# Altium project STM32_W5500_Baseboard.PrjPcb
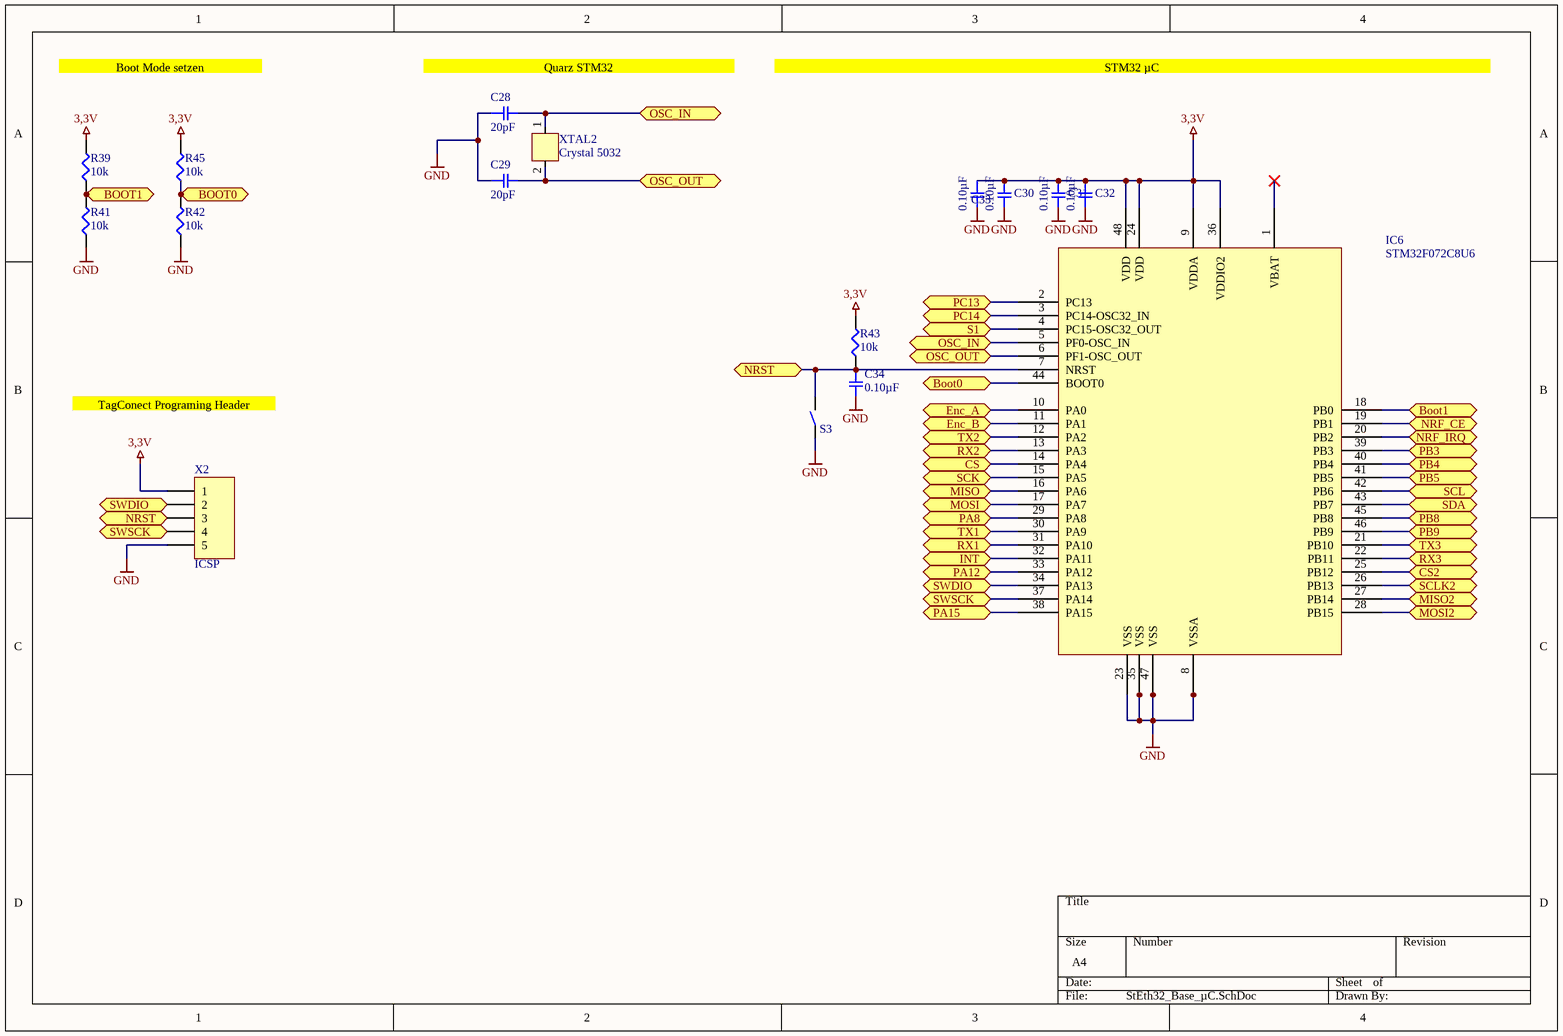
[diagram p0: StEth32_Base_µC.SchDoc]
4 sheets, 110 parts. Net scope: flat (ports and power ports of the same name join across sheets).
Board file: StEth32_Base.PcbDoc
Sheets:
  StEth32_Base_µC.SchDoc
  StEth32_Base_OLED_UserIO.SchDoc
  StEth32_Base_Power_Output.SchDoc
  StEth32_Base_W5500.SchDoc

## Sheet StEth32_Base_µC.SchDoc
size A4

### Parts
C28  20pF  [SMD-0603C]
C29  20pF  [SMD-0603C]
C30  0.10µF  [SMD-0603C]
C31  0.10µF  [SMD-0603C]
C32  0.10µF  [SMD-0603C]
C33  0.10µF  [SMD-0603C]
C34  0.10µF  [SMD-0603C]
IC6  STM32F072C8U6  [LQFP-48]
R39  10k  [SMD-0603-RES]
R41  10k  [SMD-0603-RES]
R42  10k  [SMD-0603-RES]
R43  10k  [SMD-0603-RES]
R45  10k  [SMD-0603-RES]
S3  Button  [Button5050]  (value not drawn)
X2  ICSP  [TC2030-MCP-NL]
XTAL2  Crystal 5032  [5032]

### Ports
Boot0 (bidir), BOOT0 (bidir), BOOT1 (bidir), Boot1 (bidir), CS2 (bidir), CS (bidir), Enc_A (bidir), Enc_B (bidir), INT (bidir), MISO2 (bidir), MISO (bidir), MOSI2 (bidir), MOSI (bidir), NRF_CE (bidir), NRF_IRQ (bidir), NRST (bidir), OSC_IN (bidir), OSC_OUT (bidir), PA8 (bidir), PA12 (bidir), PA15 (bidir), PB3 (bidir), PB4 (bidir), PB5 (bidir), PB8 (bidir), PB9 (bidir), PC13 (bidir), PC14 (bidir), RX1 (bidir), RX2 (bidir), RX3 (bidir), S1 (bidir), SCK (bidir), SCL (bidir), SCLK2 (bidir), SDA (bidir), SWDIO (bidir), SWSCK (bidir), TX1 (bidir), TX2 (bidir), TX3 (bidir)

### Nets
3,3V: C30.1 C31.1 C32.1 C33.1 IC6.9(VDDA) IC6.24(VDD) IC6.36(VDDIO2) IC6.48(VDD) R39.2 R43.2 R45.2 X2.1
GND: C28.1 C29.1 C30.2 C31.2 C32.2 C33.2 C34.2 IC6.8(VSSA) IC6.23(VSS) IC6.35(VSS) IC6.47(VSS) R41.1 R42.1 S3.1 X2.5
NetC28_2: C28.2 IC6.5(PF0-OSC_IN) XTAL2.1 ; port OSC_IN
NetC29_2: C29.2 IC6.6(PF1-OSC_OUT) XTAL2.2 ; port OSC_OUT
NetC34_1: C34.1 IC6.7(NRST) R43.1 S3.2 X2.3 ; port NRST
NetIC1_18: IC6.42(PB6) ; port SCL
NetIC1_19: IC6.43(PB7) ; port SDA
NetIC2_CE: IC6.19(PB1) ; port NRF_CE
NetIC2_CSN: IC6.14(PA4) ; port CS
NetIC2_IRQ: IC6.20(PB2) ; port NRF_IRQ
NetIC2_MISO: IC6.16(PA6) ; port MISO
NetIC2_MOSI: IC6.17(PA7) ; port MOSI
NetIC2_SCK: IC6.15(PA5) ; port SCK
NetIC5_32: IC6.25(PB12) ; port CS2
NetIC5_33: IC6.26(PB13) ; port SCLK2
NetIC5_34: IC6.27(PB14) ; port MISO2
NetIC5_35: IC6.28(PB15) ; port MOSI2
NetIC5_36: IC6.32(PA11) ; port INT
NetIC6_2: IC6.2(PC13) ; port PC13
NetIC6_3: IC6.3(PC14-OSC32_IN) ; port PC14
NetIC6_4: IC6.4(PC15-OSC32_OUT) ; port S1
NetIC6_10: IC6.10(PA0) ; port Enc_A
NetIC6_11: IC6.11(PA1) ; port Enc_B
NetIC6_12: IC6.12(PA2) ; port TX2
NetIC6_13: IC6.13(PA3) ; port RX2
NetIC6_18: IC6.18(PB0) R39.1 R41.2 ; port BOOT1, port Boot1
NetIC6_21: IC6.21(PB10) ; port TX3
NetIC6_22: IC6.22(PB11) ; port RX3
NetIC6_29: IC6.29(PA8) ; port PA8
NetIC6_30: IC6.30(PA9) ; port TX1
NetIC6_31: IC6.31(PA10) ; port RX1
NetIC6_33: IC6.33(PA12) ; port PA12
NetIC6_34: IC6.34(PA13) X2.2 ; port SWDIO
NetIC6_37: IC6.37(PA14) X2.4 ; port SWSCK
NetIC6_38: IC6.38(PA15) ; port PA15
NetIC6_39: IC6.39(PB3) ; port PB3
NetIC6_40: IC6.40(PB4) ; port PB4
NetIC6_41: IC6.41(PB5) ; port PB5
NetIC6_44: IC6.44(BOOT0) R42.2 R45.1 ; port Boot0, port BOOT0
NetIC6_45: IC6.45(PB8) ; port PB8
NetIC6_46: IC6.46(PB9) ; port PB9

Not connected (* = marked no-connect by the designer): IC6 1(VBAT)*

### Notes on the sheet
- Boot Mode setzen
- Quarz STM32
- STM32 µC
  STM32 µC
- TagConect Programing Header

### Library data of the parts
C28-C34 = GCM188R71C104KA37J: CAP CER 0.1UF 16V X7R 0603; Manufacturer: Murata Electronics North America; Factory Stock: 0; Unit Price (USD): 0.18; Minimum Quantity: 1; Tolerance: ±10%; Datasheets: http://www.murata.com/~/media/webrenewal/support/library/catalog/products/capacitor/mlcc/c03e.ashx; Image: //media.digikey.com/Renders/Murata%20Renders/0603%28GCM188%29.jpg; Digi-Key Part Number: 490-8015-1-ND; Part Number: GCM188R71C104KA37J; Quantity Available: 17844; @ qty: 0; Packaging: Cut Tape (CT); Series: GCM; Part Status: Active; Voltage: 16V; Temperature Coefficient: X7R; Operating Temperature: -55°C ~ 125°C; Features: -; Ratings: AEC-Q200; Applications: Automotive; Mounting Type: Surface Mount, MLCC; Package / Case: 0603 (1608 Metric); Size / Dimension: 0.063" L x 0.031" W (1.60mm x 0.80mm); Height - Seated (Max): -; Thickness (Max): 0.035" (0.90mm); Lead Spacing: -; Lead Style: -
  C28 C29: Value: 20pF
  C30-C34: Value: 0.10µF
R39 R41-R43 R45 = ERJ-3EKF1002V: RES SMD 10K OHM 1% 1/10W 0603; Manufacturer: Panasonic Electronic Components; Factory Stock: 0; Unit Price (USD): 0.00379; @ qty: 1500; Minimum Quantity: 1; Power (Watts): 0.1W, 1/10W; Temperature Coefficient: ±100ppm/°C; Part Number: ERJ-3EKF1002V; Datasheets: http://industrial.panasonic.com/www-cgi/jvcr13pz.cgi?E+PZ+3+AOA0002+ERJ3EKF1002V+7+WW; Image: //media.digikey.com/Photos/Panasonic%20Photos/MFG_ERJ-P6W%20Series.jpg; Digi-Key Part Number: P10.0KHCT-ND; Quantity Available: 6703141; Packaging: Cut Tape (CT); Series: ERJ; Part Status: Active; Value: 10k; Tolerance: ±1%; Composition: Thick Film; Features: Automotive AEC-Q200; Operating Temperature: -55°C ~ 155°C; Package / Case: 0603 (1608 Metric); Supplier Device Package: 0603; Size / Dimension: 0.063" L x 0.031" W (1.60mm x 0.80mm); Height - Seated (Max): 0.022" (0.55mm); Number of Terminations: 2; Failure Rate: -
S3 = Button: 6.1x3.7x2.5mm
XTAL2 = 5032

## Sheet StEth32_Base_OLED_UserIO.SchDoc
size A4
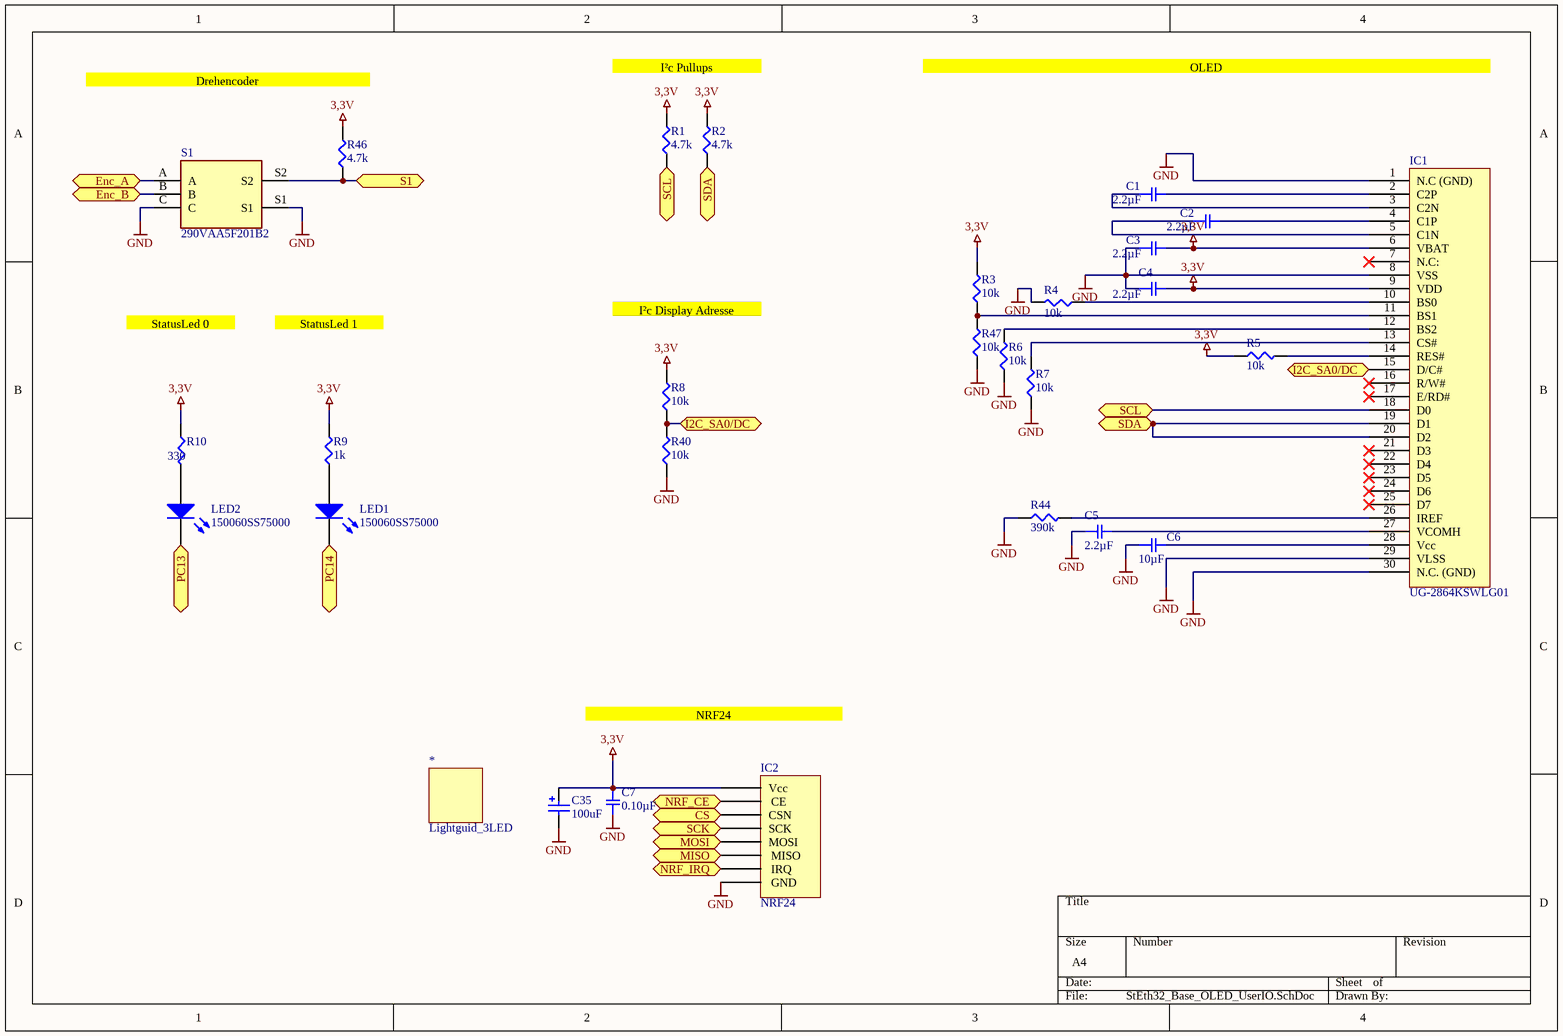
[diagram p1: StEth32_Base_OLED_UserIO.SchDoc]

### Parts
*  Lightguid_3LED  [LightGuid3]
C1  2.2µF  [SMD-0603C]
C2  2.2µF  [SMD-0603C]
C3  2.2µF  [SMD-0603C]
C4  2.2µF  [SMD-0603C]
C5  2.2µF  [SMD-0603C]
C6  10µF  [SMD-0603C]
C7  0.10µF  [SMD-0603C]
C35  value 100uF  [WCAP-ASLI_6.3x5.5]  (hidden comment: 865080243007)
IC1  UG-2864KSWLG01  [UG-2864KSWLG01]
IC2  NRF24  [ML01SP4]
LED1  150060SS75000  [0603_A]
LED2  150060SS75000  [0603_A]
R1  4.7k  [SMD-0603-RES]
R2  4.7k  [SMD-0603-RES]
R3  10k  [SMD-0603-RES]
R4  10k  [SMD-0603-RES]
R5  10k  [SMD-0603-RES]
R6  10k  [SMD-0603-RES]
R7  10k  [SMD-0603-RES]
R8  10k  [SMD-0603-RES]
R9  1k  [SMD-0603-RES]
R10  330  [SMD-0603-RES]
R40  10k  [SMD-0603-RES]
R44  390k  [SMD-0603-RES]
R46  4.7k  [SMD-0603-RES]
R47  10k  [SMD-0603-RES]
S1  290VAA5F201B2  [EC11B]

### Ports
CS (bidir), Enc_A (bidir), Enc_B (bidir), I2C_SA0/DC (bidir), MISO (bidir), MOSI (bidir), NRF_CE (bidir), NRF_IRQ (bidir), PC13 (bidir), PC14 (bidir), S1 (bidir), SCK (bidir), SCL (bidir), SDA (bidir)

### Nets
3,3V: C3.2 C4.2 C7.1 C35.1(P) IC1.6(VBAT) IC1.9(VDD) IC2.Vcc R1.2 R2.2 R3.2 R5.1 R8.2 R9.2 R10.1 R46.2
GND: C3.1 C4.1 C5.1 C6.1 C7.2 C35.2(N) IC1.1(N.C_(GND)) IC1.8(VSS) IC1.29(VLSS) IC1.30(N.C._(GND)) IC2.Gnd(GND) R4.2 R6.1 R7.1 R40.1 R44.1 R47.1 S1.C S1.S1
NetC1_1: C1.1 IC1.3(C2N)
NetC1_2: C1.2 IC1.2(C2P)
NetC2_1: C2.1 IC1.5(C1N)
NetC2_2: C2.2 IC1.4(C1P)
NetC5_2: C5.2 IC1.27(VCOMH)
NetC6_2: C6.2 IC1.28(Vcc)
NetIC1_10: IC1.10(BS0) R4.1
NetIC1_11: IC1.11(BS1) R3.1 R47.2
NetIC1_12: IC1.12(BS2) R6.2
NetIC1_13: IC1.13(CS#) R7.2
NetIC1_14: IC1.14(RES#) R5.2
NetIC1_15: IC1.15(D/C#) R8.1 R40.2 ; port I2C_SA0/DC
NetIC1_18: IC1.18(D0) R1.1 ; port SCL
NetIC1_19: IC1.19(D1) IC1.20(D2) R2.1 ; port SDA
NetIC1_26: IC1.26(IREF) R44.2
NetIC2_CE: IC2.CE ; port NRF_CE
NetIC2_CSN: IC2.CSN ; port CS
NetIC2_IRQ: IC2.IRQ ; port NRF_IRQ
NetIC2_MISO: IC2.MISO ; port MISO
NetIC2_MOSI: IC2.MOSI ; port MOSI
NetIC2_SCK: IC2.SCK ; port SCK
NetIC6_2: LED2.1(K) ; port PC13
NetIC6_3: LED1.1(K) ; port PC14
NetIC6_4: R46.1 S1.S2 ; port S1
NetIC6_10: S1.A ; port Enc_A
NetIC6_11: S1.B ; port Enc_B
NetLED1_2: LED1.2(A) R9.1
NetLED2_2: LED2.2(A) R10.2

Not connected (* = marked no-connect by the designer): IC1 7(N.C:)* 16(R/W#)* 17(E/RD#)* 21(D3)* 22(D4)* 23(D5)* 24(D6)* 25(D7)*

### Notes on the sheet
- Drehencoder
- I²c Pullups
- OLED
- I²c Display Adresse
- StatusLed 0
- StatusLed 1
- NRF24

### Library data of the parts
* = Lightguid_3LED: Lichtleiter 3Dach 90°
C1-C5 = GRM188C81C225KA12D: CAP CER 2.2UF 16V X6S 0603; Manufacturer: Murata Electronics North America; Factory Stock: 0; Unit Price (USD): 0.2; Minimum Quantity: 1; Tolerance: ±10%; Datasheets: http://www.murata.com/~/media/webrenewal/support/library/catalog/products/capacitor/mlcc/c02e.pdf; Image: //media.digikey.com/Renders/Murata%20Renders/ZRB-SERIES-0402.jpg; Digi-Key Part Number: 490-11993-1-ND; Part Number: GRM188C81C225KA12D; Quantity Available: 1215; @ qty: 0; Packaging: Cut Tape (CT); Series: GRM; Part Status: Active; Value: 2.2µF; Voltage: 16V; Temperature Coefficient: X6S; Operating Temperature: -55°C ~ 105°C; Features: -; Ratings: -; Applications: General Purpose; Mounting Type: Surface Mount, MLCC; Package / Case: 0603 (1608 Metric); Size / Dimension: 0.063" L x 0.031" W (1.60mm x 0.80mm); Height - Seated (Max): -; Thickness (Max): 0.035" (0.90mm); Lead Spacing: -; Lead Style: -
C6 = GRM185R60J106ME15D: CAP CER 10UF 6.3V X5R 0603; Manufacturer: Murata Electronics North America; Factory Stock: 0; Unit Price (USD): 0.36; Minimum Quantity: 1; Tolerance: ±20%; Datasheets: http://www.murata.com/~/media/webrenewal/support/library/catalog/products/capacitor/mlcc/c02e.pdf; Image: //media.digikey.com/Renders/Murata%20Renders/ZRB-SERIES-0402.jpg; Digi-Key Part Number: 490-10467-1-ND; Part Number: GRM185R60J106ME15D; Quantity Available: 25068; @ qty: 0; Packaging: Cut Tape (CT); Series: GRM; Part Status: Active; Value: 10µF; Voltage: 6.3V; Temperature Coefficient: X5R; Operating Temperature: -55°C ~ 85°C; Features: Derating Recommended; Ratings: -; Applications: General Purpose; Mounting Type: Surface Mount, MLCC; Package / Case: 0603 (1608 Metric); Size / Dimension: 0.063" L x 0.031" W (1.60mm x 0.80mm); Height - Seated (Max): -; Thickness (Max): 0.022" (0.55mm); Lead Spacing: -; Lead Style: -
C7 = GCM188R71C104KA37J: as C28 on sheet StEth32_Base_µC; Datasheets: http://www.murata.com/~/media/webrenewal/support/library/catalog/products/capacitor/mlcc/c03e.ashx; Image: //media.digikey.com/Renders/Murata%20Renders/0603%28GCM188%29.jpg; Digi-Key Part Number: 490-8015-1-ND; Part Number: GCM188R71C104KA37J; Quantity Available: 17844; @ qty: 0; Packaging: Cut Tape (CT); Series: GCM; Part Status: Active; Value: 0.10µF; Voltage: 16V; Temperature Coefficient: X7R; Operating Temperature: -55°C ~ 125°C; Features: -; Ratings: AEC-Q200; Applications: Automotive; Mounting Type: Surface Mount, MLCC; Package / Case: 0603 (1608 Metric); Size / Dimension: 0.063" L x 0.031" W (1.60mm x 0.80mm); Height - Seated (Max): -; Thickness (Max): 0.035" (0.90mm); Lead Spacing: -; Lead Style: -
C35 = 865080243007: WCAP-ASLI Aluminum Electrolytic Capacitors, size Ф6.3x5.5mm, 10V DC, 100uF; Rated Voltage: 10V DC; ComponentLink1Description: Manufacturer; ComponentLink1URL: http://www.we-online.de; ComponentLink2Description: Datasheet; ComponentLink2URL: http://katalog.we-online.de/pbs/datasheet/865080243007.pdf; Part Number: 865080243007; Published Date: June 2017; Publisher: Wurth Elektronik; Size: Ф6.3x5.5mm; Life Cycle: 2000h; Operating Temperature: -55 °C up to +105 °C
IC1 = UG-2864KSWLG01: OLED 1,3" 128x64
LED1 LED2 = 150060SS75000: SMD mono-color Chip LED, WL-SMCW, Super Red; PackageReference: 0603_A; Color: Super Red; PartNumber: 150060SS75000; ComponentLink1Description: Manufacturer URL; ComponentLink1URL: http://www.we-online.com; ComponentLink2Description: Datasheet; ComponentLink2URL: http://katalog.we-online.com/led/datasheet/150060SS75000.pdf
R1 R2 R46 = ERJ-PA3F4701V: RES SMD 4.7K OHM 1% 1/4W 0603; Manufacturer: Panasonic Electronic Components; Factory Stock: 0; Unit Price (USD): 0.02372; @ qty: 1500; Minimum Quantity: 1; Power (Watts): 0.25W, 1/4W; Temperature Coefficient: ±100ppm/°C; Part Number: ERJ-PA3F4701V; Datasheets: https://industrial.panasonic.com/cdbs/www-data/pdf/RDA0000/AOA0000C243.pdf; Image: //media.digikey.com/Photos/Panasonic%20Photos/MFG_ERJ-P6W%20Series.jpg; Digi-Key Part Number: P4.7KBYCT-ND; Quantity Available: 14801; Packaging: Cut Tape (CT); Series: ERJ; Part Status: Active; Value: 4.7k; Tolerance: ±1%; Composition: Thick Film; Features: Automotive AEC-Q200, Pulse Withstanding; Operating Temperature: -55°C ~ 155°C; Package / Case: 0603 (1608 Metric); Supplier Device Package: 0603; Size / Dimension: 0.063" L x 0.031" W (1.60mm x 0.80mm); Height - Seated (Max): 0.022" (0.55mm); Number of Terminations: 2; Failure Rate: -
R3-R8 R40 R47 = ERJ-3EKF1002V: as R39 on sheet StEth32_Base_µC; Part Number: ERJ-3EKF1002V; Datasheets: http://industrial.panasonic.com/www-cgi/jvcr13pz.cgi?E+PZ+3+AOA0002+ERJ3EKF1002V+7+WW; Image: //media.digikey.com/Photos/Panasonic%20Photos/MFG_ERJ-P6W%20Series.jpg; Digi-Key Part Number: P10.0KHCT-ND; Quantity Available: 6703141; Packaging: Cut Tape (CT); Series: ERJ; Part Status: Active; Value: 10k; Tolerance: ±1%; Composition: Thick Film; Features: Automotive AEC-Q200; Operating Temperature: -55°C ~ 155°C; Package / Case: 0603 (1608 Metric); Supplier Device Package: 0603; Size / Dimension: 0.063" L x 0.031" W (1.60mm x 0.80mm); Height - Seated (Max): 0.022" (0.55mm); Number of Terminations: 2; Failure Rate: -
R9 = ERJ-3EKF1001V: RES SMD 1K OHM 1% 1/10W 0603; Manufacturer: Panasonic Electronic Components; Factory Stock: 0; Unit Price (USD): 0.00379; @ qty: 1500; Minimum Quantity: 1; Power (Watts): 0.1W, 1/10W; Temperature Coefficient: ±100ppm/°C; Part Number: ERJ-3EKF1001V; Datasheets: http://industrial.panasonic.com/www-cgi/jvcr13pz.cgi?E+PZ+3+AOA0002+ERJ3EKF1001V+7+WW; Image: //media.digikey.com/Photos/Panasonic%20Photos/MFG_ERJ-P6W%20Series.jpg; Digi-Key Part Number: P1.00KHCT-ND; Quantity Available: 5218845; Packaging: Cut Tape (CT); Series: ERJ; Part Status: Active; Value: 1k; Tolerance: ±1%; Composition: Thick Film; Features: Automotive AEC-Q200; Operating Temperature: -55°C ~ 155°C; Package / Case: 0603 (1608 Metric); Supplier Device Package: 0603; Size / Dimension: 0.063" L x 0.031" W (1.60mm x 0.80mm); Height - Seated (Max): 0.022" (0.55mm); Number of Terminations: 2; Failure Rate: -
R10 = ERJ-3EKF3300V: RES SMD 330 OHM 1% 1/10W 0603; Manufacturer: Panasonic Electronic Components; Factory Stock: 0; Unit Price (USD): 0.00379; @ qty: 1500; Minimum Quantity: 1; Power (Watts): 0.1W, 1/10W; Temperature Coefficient: ±100ppm/°C; Part Number: ERJ-3EKF3300V; Datasheets: http://industrial.panasonic.com/www-cgi/jvcr13pz.cgi?E+PZ+3+AOA0002+ERJ3EKF3300V+7+WW; Image: //media.digikey.com/Photos/Panasonic%20Photos/MFG_ERJ-P6W%20Series.jpg; Digi-Key Part Number: P330HCT-ND; Quantity Available: 670984; Packaging: Cut Tape (CT); Series: ERJ; Part Status: Active; Value: 330; Tolerance: ±1%; Composition: Thick Film; Features: Automotive AEC-Q200; Operating Temperature: -55°C ~ 155°C; Package / Case: 0603 (1608 Metric); Supplier Device Package: 0603; Size / Dimension: 0.063" L x 0.031" W (1.60mm x 0.80mm); Height - Seated (Max): 0.022" (0.55mm); Number of Terminations: 2; Failure Rate: -
R44 = ERJ-3EKF3903V: RES SMD 390K OHM 1% 1/10W 0603; Manufacturer: Panasonic Electronic Components; Factory Stock: 0; Unit Price (USD): 0.00379; @ qty: 1500; Minimum Quantity: 1; Power (Watts): 0.1W, 1/10W; Temperature Coefficient: ±100ppm/°C; Part Number: ERJ-3EKF3903V; Datasheets: http://industrial.panasonic.com/www-cgi/jvcr13pz.cgi?E+PZ+3+AOA0002+ERJ3EKF3903V+7+WW; Image: //media.digikey.com/Photos/Panasonic%20Photos/MFG_ERJ-P6W%20Series.jpg; Digi-Key Part Number: P390KHCT-ND; Quantity Available: 25618; Packaging: Cut Tape (CT); Series: ERJ; Part Status: Active; Value: 390k; Tolerance: ±1%; Composition: Thick Film; Features: Automotive AEC-Q200; Operating Temperature: -55°C ~ 155°C; Package / Case: 0603 (1608 Metric); Supplier Device Package: 0603; Size / Dimension: 0.063" L x 0.031" W (1.60mm x 0.80mm); Height - Seated (Max): 0.022" (0.55mm); Number of Terminations: 2; Failure Rate: -
S1 = 290VAA5F201B2: Switch; Manufacturer_Name: CTS; Datasheet Link: https://www.mouser.com/datasheet/2/96/290-1138413.pdf; Height: 26.7mm; Manufacturer_Part_Number: 290VAA5F201B2; Mouser Part Number: 774-290VAA5F201B2; Mouser Price/Stock: https://www.mouser.com/Search/Refine.aspx?Keyword=774-290VAA5F201B2; RS Part Number: 1774359; RS Price/Stock: http://uk.rs-online.com/web/p/products/1774359

## Sheet StEth32_Base_Power_Output.SchDoc
size A4
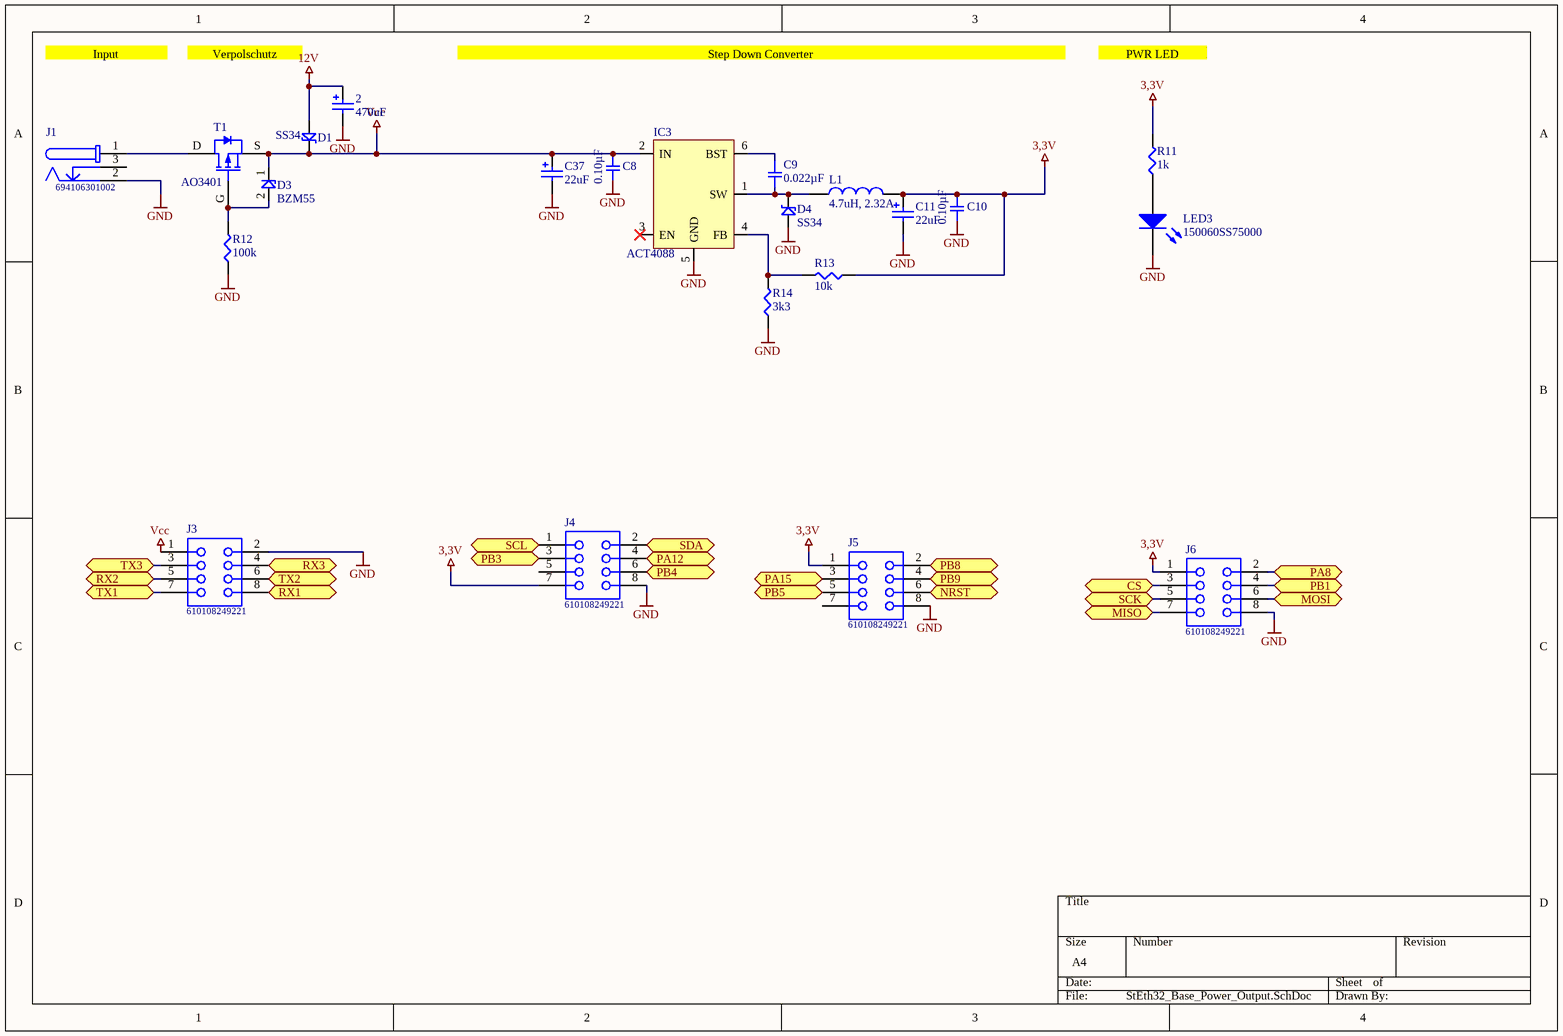
[diagram p2: StEth32_Base_Power_Output.SchDoc]

### Parts
2  value 470uF  [WCAP-ASLI_10x10.5]  (hidden comment: 865080457015)
C8  0.10µF  [SMD-0603C]
C9  0.022µF  [SMD-0603C]
C10  0.10µF  [SMD-0603C]
C11  value 22uF  [WCAP-ASLI_4x5.5]  (hidden comment: 865080140001)
C37  value 22uF  [WCAP-ASLI_4x5.5]  (hidden comment: 865080140001)
D1  SS34  [B240A]
D3  BZM55  [SMD-0603-RES]
D4  SS34  [B240A]
IC3  ACT4088  [SOT23-6]
J1  694106301002  [694106301002]
J3  610108249221  [610108249221]
J4  610108249221  [610108249221]
J5  610108249221  [610108249221]
J6  610108249221  [610108249221]
L1  4.7uH, 2.32A  [WE-PD_7332]
LED3  150060SS75000  [0603_A]
R11  1k  [SMD-0603-RES]
R12  100k  [SMD-0603-RES]
R13  10k  [SMD-0603-RES]
R14  3k3  [SMD-0603-RES]
T1  AO3401  [SOT23]

### Ports
CS (bidir), MISO (bidir), MOSI (bidir), NRST (bidir), PA8 (bidir), PA12 (bidir), PA15 (bidir), PB1 (bidir), PB3 (bidir), PB4 (bidir), PB5 (bidir), PB8 (bidir), PB9 (bidir), RX1 (bidir), RX2 (bidir), RX3 (bidir), SCK (bidir), SCL (bidir), SDA (bidir), TX1 (bidir), TX2 (bidir), TX3 (bidir)

### Nets
3,3V: C10.1 C11.1(P) J4.7 J5.1 J6.1 L1.2 R11.2 R13.1
12V: 2.1(P) D1.A
GND: 2.2(N) C8.2 C10.2 C11.2(N) C37.2(N) D4.A IC3.5(GND) J1.2 J3.2 J4.8 J5.8 J6.8 LED3.1(K) R12.1 R14.1
Vcc: C8.1 C37.1(P) D1.K D3.1 IC3.2(IN) J3.1 T1.S
NetC9_1: C9.1 IC3.6(BST)
NetC9_2: C9.2 D4.K IC3.1(SW) L1.1
NetC34_1: J5.6 ; port NRST
NetD3_2: D3.2 R12.2 T1.G
NetIC1_18: J4.1 ; port SCL
NetIC1_19: J4.2 ; port SDA
NetIC2_CSN: J6.3 ; port CS
NetIC2_MISO: J6.7 ; port MISO
NetIC2_MOSI: J6.6 ; port MOSI
NetIC2_SCK: J6.5 ; port SCK
NetIC3_4: IC3.4(FB) R13.2 R14.2
NetIC6_12: J3.6 ; port TX2
NetIC6_13: J3.5 ; port RX2
NetIC6_21: J3.3 ; port TX3
NetIC6_22: J3.4 ; port RX3
NetIC6_29: J6.2 ; port PA8
NetIC6_30: J3.7 ; port TX1
NetIC6_31: J3.8 ; port RX1
NetIC6_33: J4.4 ; port PA12
NetIC6_38: J5.3 ; port PA15
NetIC6_39: J4.3 ; port PB3
NetIC6_40: J4.6 ; port PB4
NetIC6_41: J5.5 ; port PB5
NetIC6_45: J5.2 ; port PB8
NetIC6_46: J5.4 ; port PB9
NetJ1_1: J1.1 T1.D
NetJ6_4: J6.4 ; port PB1
NetLED3_2: LED3.2(A) R11.1

Not connected (* = marked no-connect by the designer): IC3 3(EN)*; J1 3; J4 5; J5 7

### Notes on the sheet
- Input
- Verpolschutz
- Step Down Converter
- PWR LED

### Library data of the parts
2 = 865080457015: WCAP-ASLI Aluminum Electrolytic Capacitors, size Ф10x10.5mm, 25V DC, 470uF; Rated Voltage: 25V DC; ComponentLink1Description: Manufacturer; ComponentLink1URL: http://www.we-online.de; ComponentLink2Description: Datasheet; ComponentLink2URL: http://katalog.we-online.de/pbs/datasheet/865080457015.pdf; Part Number: 865080457015; Published Date: June 2017; Publisher: Wurth Elektronik; Size: Ф10x10.5mm; Life Cycle: 2000h; Operating Temperature: -55 °C up to +105 °C
C8 C10 = GCM188R71C104KA37J: as C28 on sheet StEth32_Base_µC; Datasheets: http://www.murata.com/~/media/webrenewal/support/library/catalog/products/capacitor/mlcc/c03e.ashx; Image: //media.digikey.com/Renders/Murata%20Renders/0603%28GCM188%29.jpg; Digi-Key Part Number: 490-8015-1-ND; Part Number: GCM188R71C104KA37J; Quantity Available: 17844; @ qty: 0; Packaging: Cut Tape (CT); Series: GCM; Part Status: Active; Value: 0.10µF; Voltage: 16V; Temperature Coefficient: X7R; Operating Temperature: -55°C ~ 125°C; Features: -; Ratings: AEC-Q200; Applications: Automotive; Mounting Type: Surface Mount, MLCC; Package / Case: 0603 (1608 Metric); Size / Dimension: 0.063" L x 0.031" W (1.60mm x 0.80mm); Height - Seated (Max): -; Thickness (Max): 0.035" (0.90mm); Lead Spacing: -; Lead Style: -
C9 = GCJ188R71H223KA01D: CAP CER 0.022UF 50V X7R 0603; Manufacturer: Murata Electronics North America; Factory Stock: 0; Unit Price (USD): 0.22; Minimum Quantity: 1; Tolerance: ±10%; Datasheets: http://www.murata.com/~/media/webrenewal/support/library/catalog/products/capacitor/mlcc/c03e.ashx; Image: //media.digikey.com/Renders/Murata%20Renders/0603%28LQG18%29.jpg; Digi-Key Part Number: 490-5851-1-ND; Part Number: GCJ188R71H223KA01D; Quantity Available: 7651; @ qty: 0; Packaging: Cut Tape (CT); Series: GCJ; Part Status: Active; Value: 0.022µF; Voltage: 50V; Temperature Coefficient: X7R; Operating Temperature: -55°C ~ 125°C; Features: Soft Termination; Ratings: AEC-Q200; Applications: Automotive, Boardflex Sensitive; Mounting Type: Surface Mount, MLCC; Package / Case: 0603 (1608 Metric); Size / Dimension: 0.063" L x 0.031" W (1.60mm x 0.80mm); Height - Seated (Max): -; Thickness (Max): 0.031" (0.80mm); Lead Spacing: -; Lead Style: -
C11 C37 = 865080140001: WCAP-ASLI Aluminum Electrolytic Capacitors, size Ф4x5.5mm, 6.3V DC, 22uF; Rated Voltage: 6.3V DC; ComponentLink1Description: Manufacturer; ComponentLink1URL: http://www.we-online.de; ComponentLink2Description: Datasheet; ComponentLink2URL: http://katalog.we-online.de/pbs/datasheet/865080140001.pdf; Part Number: 865080140001; Published Date: June 2017; Publisher: Wurth Elektronik; Size: Ф4x5.5mm; Life Cycle: 2000h; Operating Temperature: -55 °C up to +105 °C
D1 D4 = B240A: Shottkydiode
J1 = 694106301002: DC Power Jack Connector WR-DC, Male, Right Angled, THT, 5 A, 24 V; Opening Diameter: 6.4 mm; Plug Inner Diameter: 2.05 mm; Plug Outer Diameter: 5.5 mm; Rated Current: 5 A; Working Voltage: 24 V; ComponentLink1Description: Manufacturer; ComponentLink1URL: http://www.we-online.de; ComponentLink2Description: Datasheet; ComponentLink2URL: http://katalog.we-online.de/em/datasheet/6941xx301002.pdf; Part Number: 694106301002; Published Date: August 2018; Publisher: Wurth Elektronik; Orientation: Right Angled; Operating Temperature: -40 to 85 degC; Mounting Technology: THT; Gender: Male; Packaging: Bag
J3-J6 = 610108249221: WR-PHD Socket Header, SMT, pitch 2.54mm, Dual Row, Angled, 8pin; Pin Number: 8; Gender: Female; Rated Current: 3A; Working Voltage: 250VAC; Withstanding Voltage: 600VAC; Contact Resistance: 20mOhm; ComponentLink1Description: Manufacturer; ComponentLink1URL: http://www.we-online.de; ComponentLink2Description: Datasheet; ComponentLink2URL: https://katalog.we-online.de/em/datasheet/6101xx249221.pdf; Part Number: 610108249221; Published Date: June 2019; Publisher: Wurth Elektronik; Pitch: 2.54mm; Operating Temperature: -40 to +105degC; Mounting Technology: SMT; Packaging: Tape and Reel; Row Number: Dual; Orientation: Angled
L1 = 744778004: WE-PD SMT Power Inductor, size 7332, 4.7uH, 2.32A; DC Resistance max.: 60mOhm; Self Resonant Frequency: 45MHz; Saturation Current: 4.2A; ComponentLink1Description: Manufacturer; ComponentLink1URL: http://www.we-online.de; ComponentLink2Description: Datasheet; ComponentLink2URL: https://katalog.we-online.com/pbs/datasheet/744778004.pdf; Part Number: 744778004; Published Date: April 2019; Publisher: Wurth Elektronik; Rated Current: 2.32A; Size: 7332; Inductance: 4.7uH; Operating Temperature: -40 to +125degC; Mounting Technology: SMT; Packaging: Tape and Reel
LED3 = 150060SS75000: as LED1 on sheet StEth32_Base_OLED_UserIO; PackageReference: 0603_A; Color: Super Red; PartNumber: 150060SS75000; ComponentLink1Description: Manufacturer URL; ComponentLink1URL: http://www.we-online.com; ComponentLink2Description: Datasheet; ComponentLink2URL: http://katalog.we-online.com/led/datasheet/150060SS75000.pdf
R11 R13 R14 = ERJ-3EKF1001V: as R9 on sheet StEth32_Base_OLED_UserIO; Part Number: ERJ-3EKF1001V; Datasheets: http://industrial.panasonic.com/www-cgi/jvcr13pz.cgi?E+PZ+3+AOA0002+ERJ3EKF1001V+7+WW; Image: //media.digikey.com/Photos/Panasonic%20Photos/MFG_ERJ-P6W%20Series.jpg; Digi-Key Part Number: P1.00KHCT-ND; Quantity Available: 5218845; Packaging: Cut Tape (CT); Series: ERJ; Part Status: Active; Tolerance: ±1%; Composition: Thick Film; Features: Automotive AEC-Q200; Operating Temperature: -55°C ~ 155°C; Package / Case: 0603 (1608 Metric); Supplier Device Package: 0603; Size / Dimension: 0.063" L x 0.031" W (1.60mm x 0.80mm); Height - Seated (Max): 0.022" (0.55mm); Number of Terminations: 2; Failure Rate: -
  R11: Value: 1k
  R13: Value: 10k
  R14: Value: 3k3
R12 = ERJ-3EKF4701V: RES SMD 4.7K OHM 1% 1/10W 0603; Manufacturer: Panasonic Electronic Components; Factory Stock: 0; Unit Price (USD): 0.00379; @ qty: 1500; Minimum Quantity: 1; Power (Watts): 0.1W, 1/10W; Temperature Coefficient: ±100ppm/°C; Part Number: ERJ-3EKF4701V; Datasheets: http://industrial.panasonic.com/www-cgi/jvcr13pz.cgi?E+PZ+3+AOA0002+ERJ3EKF4701V+7+WW; Image: //media.digikey.com/Photos/Panasonic%20Photos/MFG_ERJ-P6W%20Series.jpg; Digi-Key Part Number: P4.70KHCT-ND; Quantity Available: 999380; Packaging: Cut Tape (CT); Series: ERJ; Part Status: Active; Value: 100k; Tolerance: ±1%; Composition: Thick Film; Features: Automotive AEC-Q200; Operating Temperature: -55°C ~ 155°C; Package / Case: 0603 (1608 Metric); Supplier Device Package: 0603; Size / Dimension: 0.063" L x 0.031" W (1.60mm x 0.80mm); Height - Seated (Max): 0.022" (0.55mm); Number of Terminations: 2; Failure Rate: -
T1 = AO3401: AO3401 MOSFET 30V

## Sheet StEth32_Base_W5500.SchDoc
size A4
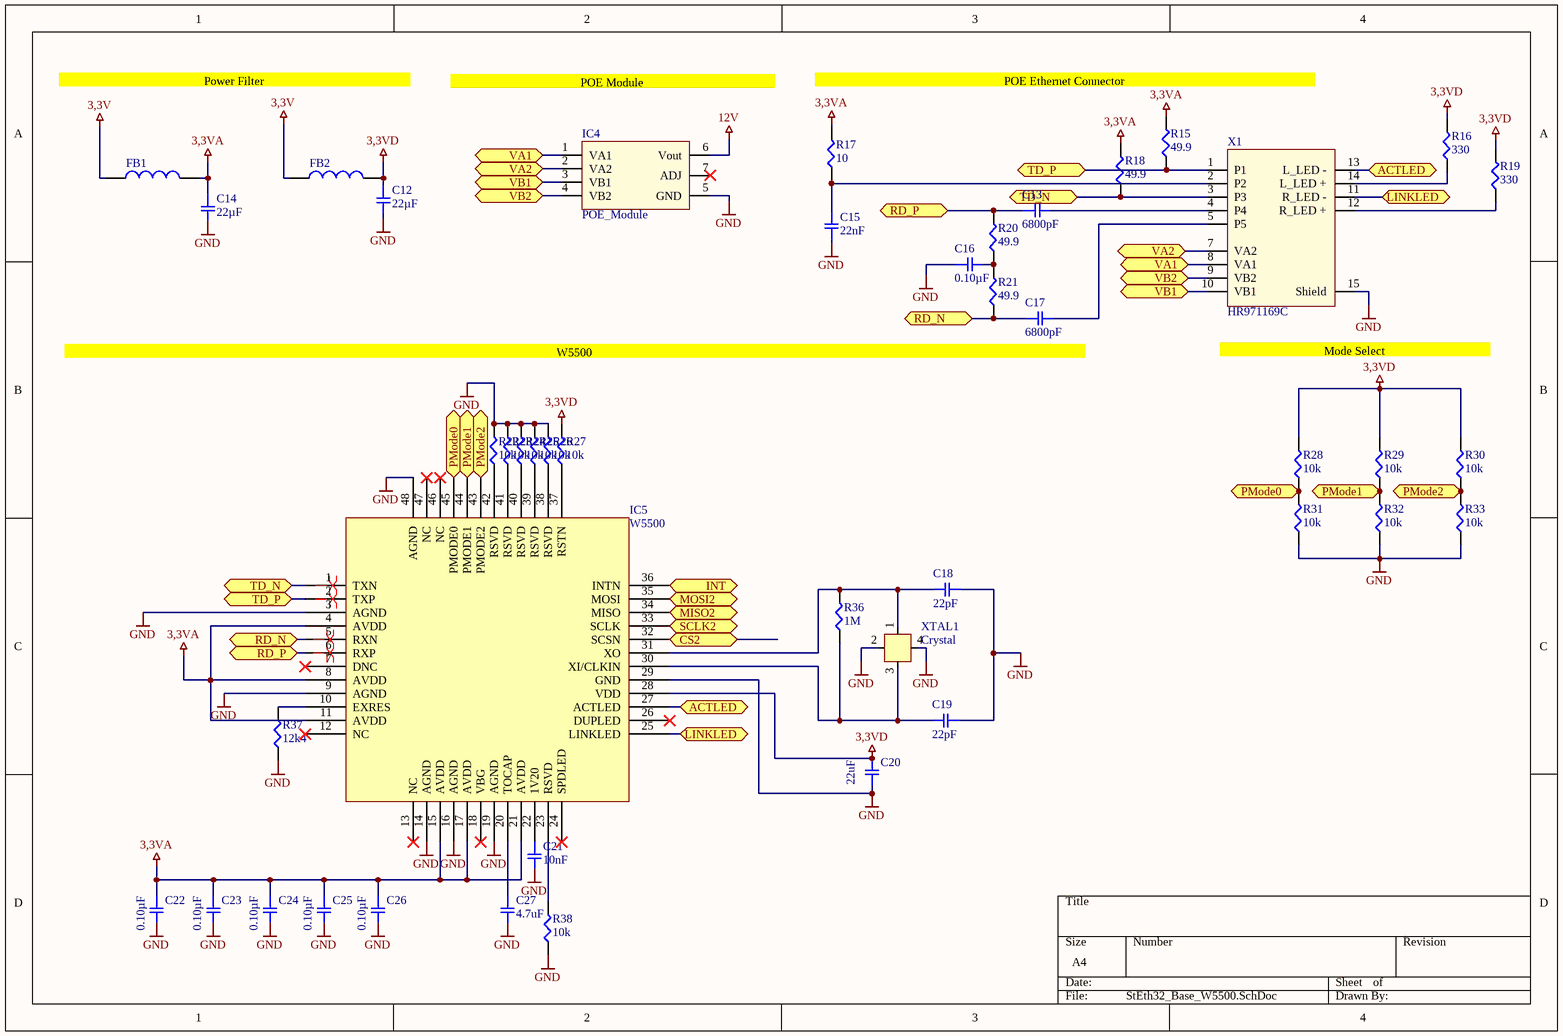
[diagram p3: StEth32_Base_W5500.SchDoc]

### Parts
C12  22µF  [SMD-0603C]
C13  6800pF  [SMD-0603C]
C14  22µF  [SMD-0603C]
C15  22nF  [SMD-0603C]
C16  0.10µF  [SMD-0603C]
C17  6800pF  [SMD-0603C]
C18  22pF  [SMD-0603C]
C19  22pF  [SMD-0603C]
C20  22uF  [SMD-0603C]
C21  10nF  [SMD-0603C]
C22  0.10µF  [SMD-0603C]
C23  0.10µF  [SMD-0603C]
C24  0.10µF  [SMD-0603C]
C25  0.10µF  [SMD-0603C]
C26  0.10µF  [SMD-0603C]
C27  4.7uF  [SMD-0603C]
FB1  600Ohm, 0.2A  [WE-CBF_0805_High Speed]  (value not drawn)
FB2  600Ohm, 0.2A  [WE-CBF_0805_High Speed]  (value not drawn)
IC4  POE_Module  [POE_Module]
IC5  W5500  [LQFP-48]
R15  49.9  [SMD-0603-RES]
R16  330  [SMD-0603-RES]
R17  10  [SMD-0603-RES]
R18  49.9  [SMD-0603-RES]
R19  330  [SMD-0603-RES]
R20  49.9  [SMD-0603-RES]
R21  49.9  [SMD-0603-RES]
R22  10k  [SMD-0603-RES]
R23  10k  [SMD-0603-RES]
R24  10k  [SMD-0603-RES]
R25  10k  [SMD-0603-RES]
R26  10k  [SMD-0603-RES]
R27  10k  [SMD-0603-RES]
R28  10k  [SMD-0603-RES]
R29  10k  [SMD-0603-RES]
R30  10k  [SMD-0603-RES]
R31  10k  [SMD-0603-RES]
R32  10k  [SMD-0603-RES]
R33  10k  [SMD-0603-RES]
R36  1M  [SMD-0402-RES]
R37  12k4  [SMD-0603-RES]
R38  10k  [SMD-0603-RES]
X1  HR971169C  [HR971169C]
XTAL1  Crystal  [3225]

### Ports
ACTLED (bidir), CS2 (bidir), INT (bidir), LINKLED (bidir), MISO2 (bidir), MOSI2 (bidir), PMode0 (bidir), PMode1 (bidir), PMode2 (bidir), RD_N (bidir), RD_P (bidir), SCLK2 (bidir), TD_N (bidir), TD_P (bidir), VA1 (bidir), VA2 (bidir), VB1 (bidir), VB2 (bidir)

### Nets
3,3V: FB1.1 FB2.1
3,3VA: C14.1 C22.1 C23.1 C24.1 C25.1 C26.1 FB1.2 IC5.4(AVDD) IC5.8(AVDD) IC5.11(AVDD) IC5.15(AVDD) IC5.17(AVDD) IC5.21(AVDD) R15.2 R17.2 R18.2
3,3VD: C12.1 C20.1 FB2.2 IC5.28(VDD) R16.2 R19.2 R27.2 R28.2 R29.2 R30.2
12V: IC4.6(Vout)
GND: C12.2 C14.2 C15.1 C16.1 C18.1 C19.1 C20.2 C21.2 C22.2 C23.2 C24.2 C25.2 C26.2 C27.2 IC4.5(GND) IC5.3(AGND) IC5.9(AGND) IC5.14(AGND) IC5.16(AGND) IC5.19(AGND) IC5.29(GND) IC5.48(AGND) R22.2 R23.2 R24.2 R25.2 R26.2 R31.1 R32.1 R33.1 R37.1 R38.1 X1.15(Shield) XTAL1.2 XTAL1.4
NetC13_1: C13.1 IC5.6(RXP) R20.2 ; port RD_P
NetC13_2: C13.2 X1.4(P4)
NetC15_2: C15.2 R17.1 X1.2(P2)
NetC16_2: C16.2 R20.1 R21.2
NetC17_1: C17.1 IC5.5(RXN) R21.1 ; port RD_N
NetC17_2: C17.2 X1.5(P5)
NetC18_2: C18.2 IC5.31(XO) R36.2 XTAL1.1
NetC19_2: C19.2 IC5.30(XI/CLKIN) R36.1 XTAL1.3
NetC21_1: C21.1 IC5.22(1V20)
NetC27_1: C27.1 IC5.20(TOCAP)
NetIC4_1: IC4.1(VA1) X1.8(VA1) ; port VA1
NetIC4_2: IC4.2(VA2) X1.7(VA2) ; port VA2
NetIC4_3: IC4.3(VB1) X1.10(VB1) ; port VB1
NetIC4_4: IC4.4(VB2) X1.9(VB2) ; port VB2
NetIC5_1: IC5.1(TXN) R18.1 X1.3(P3) ; port TD_N
NetIC5_2: IC5.2(TXP) R15.1 X1.1(P1) ; port TD_P
NetIC5_10: IC5.10(EXRES) R37.2
NetIC5_23: IC5.23(RSVD) R38.2
NetIC5_25: IC5.25(LINKLED) X1.11(R_LED_-) ; port LINKLED
NetIC5_27: IC5.27(ACTLED) X1.13(L_LED_-) ; port ACTLED
NetIC5_32: IC5.32(SCSN) ; port CS2
NetIC5_33: IC5.33(SCLK) ; port SCLK2
NetIC5_34: IC5.34(MISO) ; port MISO2
NetIC5_35: IC5.35(MOSI) ; port MOSI2
NetIC5_36: IC5.36(INTN) ; port INT
NetIC5_37: IC5.37(RSTN) R27.1
NetIC5_38: IC5.38(RSVD) R26.1
NetIC5_39: IC5.39(RSVD) R25.1
NetIC5_40: IC5.40(RSVD) R24.1
NetIC5_41: IC5.41(RSVD) R23.1
NetIC5_42: IC5.42(RSVD) R22.1
NetIC5_43: IC5.43(PMODE2) R30.1 R33.2 ; port PMode2
NetIC5_44: IC5.44(PMODE1) R29.1 R32.2 ; port PMode1
NetIC5_45: IC5.45(PMODE0) R28.1 R31.2 ; port PMode0
NetR16_1: R16.1 X1.14(L_LED_+)
NetR19_1: R19.1 X1.12(R_LED_+)

Not connected (* = marked no-connect by the designer): IC4 7(ADJ)*; IC5 7(DNC)* 12(NC)* 13(NC)* 18(VBG)* 24(SPDLED)* 26(DUPLED)* 46(NC)* 47(NC)*

### Layout directives
differential pair: (no net found under the mark)

### Notes on the sheet
- Power Filter
- POE Module
- POE Ethernet Connector
- W5500
- (near X1) Mode Select

### Library data of the parts
C12 C14 = ZRB186R60G226ME11L: CAP CER 22UF 4V X5R 0603; Manufacturer: Murata Electronics North America; Factory Stock: 0; Unit Price (USD): 0.36; Minimum Quantity: 1; Tolerance: ±20%; Datasheets: http://psearch.en.murata.com/capacitor/product/ZRB186R60G226ME11%23.pdf; Image: //media.digikey.com/Renders/Murata%20Renders/0603%20(1608%20Metric).jpg; Digi-Key Part Number: 490-13253-1-ND; Part Number: ZRB186R60G226ME11L; Quantity Available: 3925; @ qty: 0; Packaging: Cut Tape (CT); Series: ZRB; Part Status: Active; Value: 22µF; Voltage: 4V; Temperature Coefficient: X5R; Operating Temperature: -55°C ~ 85°C; Features: Interposer Termination; Ratings: -; Applications: Acoustic Noise Reduction; Mounting Type: Surface Mount, MLCC; Package / Case: 0603 (1608 Metric); Size / Dimension: 0.063" L x 0.031" W (1.60mm x 0.80mm); Height - Seated (Max): -; Thickness (Max): 0.031" (0.80mm); Lead Spacing: -; Lead Style: -
C13 C17 = GCM188R71H682KA37D: CAP CER 6800PF 50V X7R 0603; Manufacturer: Murata Electronics North America; Factory Stock: 0; Unit Price (USD): 0.1; Minimum Quantity: 1; Tolerance: ±10%; Datasheets: http://www.murata.com/~/media/webrenewal/support/library/catalog/products/capacitor/mlcc/c03e.ashx; Image: //media.digikey.com/Renders/Murata%20Renders/0603%28GCM188%29.jpg; Digi-Key Part Number: 490-6055-1-ND; Part Number: GCM188R71H682KA37D; Quantity Available: 31753; @ qty: 0; Packaging: Cut Tape (CT); Series: GCM; Part Status: Active; Value: 6800pF; Voltage: 50V; Temperature Coefficient: X7R; Operating Temperature: -55°C ~ 125°C; Features: -; Ratings: AEC-Q200; Applications: Automotive; Mounting Type: Surface Mount, MLCC; Package / Case: 0603 (1608 Metric); Size / Dimension: 0.063" L x 0.031" W (1.60mm x 0.80mm); Height - Seated (Max): -; Thickness (Max): 0.035" (0.90mm); Lead Spacing: -; Lead Style: -
C15 C18 C19 = GCM188R72A223KA37D: CAP CER 0.022UF 100V X7R 0603; Manufacturer: Murata Electronics North America; Factory Stock: 0; Unit Price (USD): 0.11; Minimum Quantity: 1; Tolerance: ±10%; Datasheets: http://www.murata.com/~/media/webrenewal/support/library/catalog/products/capacitor/mlcc/c03e.ashx; Image: //media.digikey.com/Renders/Murata%20Renders/0603%28GCM188%29.jpg; Digi-Key Part Number: 490-4782-1-ND; Part Number: GCM188R72A223KA37D; Quantity Available: 102005; @ qty: 0; Packaging: Cut Tape (CT); Series: GCM; Part Status: Active; Voltage: 100V; Temperature Coefficient: X7R; Operating Temperature: -55°C ~ 125°C; Features: -; Ratings: AEC-Q200; Applications: Automotive; Mounting Type: Surface Mount, MLCC; Package / Case: 0603 (1608 Metric); Size / Dimension: 0.063" L x 0.031" W (1.60mm x 0.80mm); Height - Seated (Max): -; Thickness (Max): 0.035" (0.90mm); Lead Spacing: -; Lead Style: -
  C15: Value: 22nF
  C18 C19: Value: 22pF
C16 C21 = GCJ188R71C104KA01D: CAP CER 0.1UF 16V X7R 0603; Manufacturer: Murata Electronics North America; Factory Stock: 0; Unit Price (USD): 0.21; Minimum Quantity: 1; Tolerance: ±10%; Datasheets: http://www.murata.com/~/media/webrenewal/support/library/catalog/products/capacitor/mlcc/c03e.ashx; Image: //media.digikey.com/Renders/Murata%20Renders/0603%28LQG18%29.jpg; Digi-Key Part Number: 490-5796-1-ND; Part Number: GCJ188R71C104KA01D; Quantity Available: 22473; @ qty: 0; Packaging: Cut Tape (CT); Series: GCJ; Part Status: Active; Voltage: 16V; Temperature Coefficient: X7R; Operating Temperature: -55°C ~ 125°C; Features: Soft Termination; Ratings: AEC-Q200; Applications: Automotive, Boardflex Sensitive; Mounting Type: Surface Mount, MLCC; Package / Case: 0603 (1608 Metric); Size / Dimension: 0.063" L x 0.031" W (1.60mm x 0.80mm); Height - Seated (Max): -; Thickness (Max): 0.035" (0.90mm); Lead Spacing: -; Lead Style: -
  C16: Value: 0.10µF
  C21: Value: 10nF
C20 = GCM188R71C104KA37J: CAP CER 0.1UF 16V X7R 0603; Manufacturer: Murata Electronics North America; Factory Stock: 0; Unit Price (USD): 0.18; Minimum Quantity: 1; Tolerance: ±10%; Voltage: 6.3V; Datasheets: http://www.murata.com/~/media/webrenewal/support/library/catalog/products/capacitor/mlcc/c03e.ashx; Image: //media.digikey.com/Renders/Murata%20Renders/0603%28GCM188%29.jpg; Digi-Key Part Number: 490-8015-1-ND; Part Number: GCM188R71C104KA37J; Quantity Available: 17844; @ qty: 0; Packaging: Cut Tape (CT); Series: GCM; Part Status: Active; Value: 22uF; Temperature Coefficient: X7R; Operating Temperature: -55°C ~ 125°C; Features: -; Ratings: AEC-Q200; Applications: Automotive; Mounting Type: Surface Mount, MLCC; Package / Case: 0603 (1608 Metric); Size / Dimension: 0.063" L x 0.031" W (1.60mm x 0.80mm); Height - Seated (Max): -; Thickness (Max): 0.035" (0.90mm); Lead Spacing: -; Lead Style: -
C22-C26 = GCM188R71C104KA37J: as C28 on sheet StEth32_Base_µC; Datasheets: http://www.murata.com/~/media/webrenewal/support/library/catalog/products/capacitor/mlcc/c03e.ashx; Image: //media.digikey.com/Renders/Murata%20Renders/0603%28GCM188%29.jpg; Digi-Key Part Number: 490-8015-1-ND; Part Number: GCM188R71C104KA37J; Quantity Available: 17844; @ qty: 0; Packaging: Cut Tape (CT); Series: GCM; Part Status: Active; Value: 0.10µF; Voltage: 16V; Temperature Coefficient: X7R; Operating Temperature: -55°C ~ 125°C; Features: -; Ratings: AEC-Q200; Applications: Automotive; Mounting Type: Surface Mount, MLCC; Package / Case: 0603 (1608 Metric); Size / Dimension: 0.063" L x 0.031" W (1.60mm x 0.80mm); Height - Seated (Max): -; Thickness (Max): 0.035" (0.90mm); Lead Spacing: -; Lead Style: -
C27 = GCJ188R71C104KA01D: CAP CER 0.1UF 16V X7R 0603; Manufacturer: Murata Electronics North America; Factory Stock: 0; Unit Price (USD): 0.21; Minimum Quantity: 1; Tolerance: ±10%; Voltage: 6.3V; Datasheets: http://www.murata.com/~/media/webrenewal/support/library/catalog/products/capacitor/mlcc/c03e.ashx; Image: //media.digikey.com/Renders/Murata%20Renders/0603%28LQG18%29.jpg; Digi-Key Part Number: 490-5796-1-ND; Part Number: GCJ188R71C104KA01D; Quantity Available: 22473; @ qty: 0; Packaging: Cut Tape (CT); Series: GCJ; Part Status: Active; Value: 4.7uF; Temperature Coefficient: X7R; Operating Temperature: -55°C ~ 125°C; Features: Soft Termination; Ratings: AEC-Q200; Applications: Automotive, Boardflex Sensitive; Mounting Type: Surface Mount, MLCC; Package / Case: 0603 (1608 Metric); Size / Dimension: 0.063" L x 0.031" W (1.60mm x 0.80mm); Height - Seated (Max): -; Thickness (Max): 0.035" (0.90mm); Lead Spacing: -; Lead Style: -
FB1 FB2 = 742792042: WE-CBF SMT EMI Suppression Ferrite Bead, size 0805, 600Ohm, 0.2A; Impedance max.: 3000Ohm; DC Resistance max.: 0.5Ohm; Type: High Speed; ComponentLink1Description: Manufacturer; ComponentLink1URL: http://www.we-online.de; ComponentLink2Description: Datasheet; ComponentLink2URL: https://katalog.we-online.com/pbs/datasheet/742792042.pdf; Part Number: 742792042; Published Date: March 2019; Publisher: Wurth Elektronik; Rated Current: 0.2A; Operating Temperature: -55 to +125degC; Impedance@100 MHz: 600Ohm; Mounting Technology: SMT; Packaging: Tape and Reel; Size: 0805
R15 R18 R20 R21 = ERJ-3EKF49R9V: RES SMD 49.9 OHM 1% 1/10W 0603; Manufacturer: Panasonic Electronic Components; Factory Stock: 0; Unit Price (USD): 0.00379; @ qty: 1500; Minimum Quantity: 1; Power (Watts): 0.1W, 1/10W; Temperature Coefficient: ±100ppm/°C; Part Number: ERJ-3EKF49R9V; Datasheets: http://industrial.panasonic.com/www-cgi/jvcr13pz.cgi?E+PZ+3+AOA0002+ERJ3EKF49R9V+7+WW; Image: //media.digikey.com/Photos/Panasonic%20Photos/MFG_ERJ-P6W%20Series.jpg; Digi-Key Part Number: P49.9HCT-ND; Quantity Available: 566023; Packaging: Cut Tape (CT); Series: ERJ; Part Status: Active; Value: 49.9; Tolerance: ±1%; Composition: Thick Film; Features: Automotive AEC-Q200; Operating Temperature: -55°C ~ 155°C; Package / Case: 0603 (1608 Metric); Supplier Device Package: 0603; Size / Dimension: 0.063" L x 0.031" W (1.60mm x 0.80mm); Height - Seated (Max): 0.022" (0.55mm); Number of Terminations: 2; Failure Rate: -
R16 R17 R19 = ERJ-3EKF3300V: as R10 on sheet StEth32_Base_OLED_UserIO; Part Number: ERJ-3EKF3300V; Datasheets: http://industrial.panasonic.com/www-cgi/jvcr13pz.cgi?E+PZ+3+AOA0002+ERJ3EKF3300V+7+WW; Image: //media.digikey.com/Photos/Panasonic%20Photos/MFG_ERJ-P6W%20Series.jpg; Digi-Key Part Number: P330HCT-ND; Quantity Available: 670984; Packaging: Cut Tape (CT); Series: ERJ; Part Status: Active; Tolerance: ±1%; Composition: Thick Film; Features: Automotive AEC-Q200; Operating Temperature: -55°C ~ 155°C; Package / Case: 0603 (1608 Metric); Supplier Device Package: 0603; Size / Dimension: 0.063" L x 0.031" W (1.60mm x 0.80mm); Height - Seated (Max): 0.022" (0.55mm); Number of Terminations: 2; Failure Rate: -
  R16 R19: Value: 330
  R17: Value: 10
R22-R33 R38 = ERJ-3EKF1002V: as R39 on sheet StEth32_Base_µC; Part Number: ERJ-3EKF1002V; Datasheets: http://industrial.panasonic.com/www-cgi/jvcr13pz.cgi?E+PZ+3+AOA0002+ERJ3EKF1002V+7+WW; Image: //media.digikey.com/Photos/Panasonic%20Photos/MFG_ERJ-P6W%20Series.jpg; Digi-Key Part Number: P10.0KHCT-ND; Quantity Available: 6703141; Packaging: Cut Tape (CT); Series: ERJ; Part Status: Active; Value: 10k; Tolerance: ±1%; Composition: Thick Film; Features: Automotive AEC-Q200; Operating Temperature: -55°C ~ 155°C; Package / Case: 0603 (1608 Metric); Supplier Device Package: 0603; Size / Dimension: 0.063" L x 0.031" W (1.60mm x 0.80mm); Height - Seated (Max): 0.022" (0.55mm); Number of Terminations: 2; Failure Rate: -
R36 = ERJ-2GEJ105X: RES SMD 1M OHM 5% 1/10W 0402; Manufacturer: Panasonic Electronic Components; Factory Stock: 0; Unit Price (USD): 0.00350; @ qty: 1500; Minimum Quantity: 1; Power (Watts): 0.1W, 1/10W; Temperature Coefficient: ±200ppm/°C; Part Number: ERJ-2GEJ105X; Datasheets: http://industrial.panasonic.com/www-cgi/jvcr13pz.cgi?E+PZ+3+AOA0001+ERJ2GEJ105X+7+WW; Image: //media.digikey.com/Photos/Panasonic%20Photos/ERJ-PA2-Series.jpg; Digi-Key Part Number: P1.0MJCT-ND; Quantity Available: 1082572; Packaging: Cut Tape (CT); Series: ERJ; Part Status: Active; Value: 1M; Tolerance: ±5%; Composition: Thick Film; Features: Automotive AEC-Q200; Operating Temperature: -55°C ~ 155°C; Package / Case: 0402 (1005 Metric); Supplier Device Package: 0402; Size / Dimension: 0.039" L x 0.020" W (1.00mm x 0.50mm); Height - Seated (Max): 0.016" (0.40mm); Number of Terminations: 2; Failure Rate: -
R37 = ERJ-3BQF1R1V: RES SMD 12,4 KOHM 1% 1/4W 0603; Manufacturer: Panasonic Electronic Components; Factory Stock: 0; Unit Price (USD): 0.05386; @ qty: 1500; Minimum Quantity: 1; Power (Watts): 0.25W, 1/4W; Temperature Coefficient: ±200ppm/°C; Part Number: ERJ-3BQF1R1V; Datasheets: https://industrial.panasonic.com/cdbs/www-data/pdf/RDA0000/AOA0000C239.pdf; Image: //media.digikey.com/Photos/Panasonic%20Photos/MFG_ERJ-P6W%20Series.jpg; Digi-Key Part Number: P17372CT-ND; Quantity Available: 3896; Packaging: Cut Tape (CT); Series: ERJ; Part Status: Active; Value: 12k4; Tolerance: ±1%; Composition: Thick Film; Features: Automotive AEC-Q200, Current Sense; Operating Temperature: -55°C ~ 125°C; Package / Case: 0603 (1608 Metric); Supplier Device Package: 0603; Size / Dimension: 0.063" L x 0.031" W (1.60mm x 0.80mm); Height - Seated (Max): 0.022" (0.55mm); Number of Terminations: 2; Failure Rate: -
XTAL1 = 3225

## Nets that join several sheets
3,3V: StEth32_Base_µC (12 pins), StEth32_Base_OLED_UserIO (15 pins), StEth32_Base_Power_Output (8 pins), StEth32_Base_W5500 (FB1.1 FB2.1)
12V: StEth32_Base_Power_Output (2.1 D1.A), StEth32_Base_W5500 (IC4.6)
GND: StEth32_Base_µC (15 pins), StEth32_Base_OLED_UserIO (19 pins), StEth32_Base_Power_Output (15 pins), StEth32_Base_W5500 (35 pins)
NetC34_1: StEth32_Base_µC (5 pins), StEth32_Base_Power_Output (J5.6)
NetIC1_18: StEth32_Base_µC (IC6.42), StEth32_Base_OLED_UserIO (IC1.18 R1.1), StEth32_Base_Power_Output (J4.1)
NetIC1_19: StEth32_Base_µC (IC6.43), StEth32_Base_OLED_UserIO (IC1.19 IC1.20 R2.1), StEth32_Base_Power_Output (J4.2)
NetIC2_CE: StEth32_Base_µC (IC6.19), StEth32_Base_OLED_UserIO (IC2.CE)
NetIC2_CSN: StEth32_Base_µC (IC6.14), StEth32_Base_OLED_UserIO (IC2.CSN), StEth32_Base_Power_Output (J6.3)
NetIC2_IRQ: StEth32_Base_µC (IC6.20), StEth32_Base_OLED_UserIO (IC2.IRQ)
NetIC2_MISO: StEth32_Base_µC (IC6.16), StEth32_Base_OLED_UserIO (IC2.MISO), StEth32_Base_Power_Output (J6.7)
NetIC2_MOSI: StEth32_Base_µC (IC6.17), StEth32_Base_OLED_UserIO (IC2.MOSI), StEth32_Base_Power_Output (J6.6)
NetIC2_SCK: StEth32_Base_µC (IC6.15), StEth32_Base_OLED_UserIO (IC2.SCK), StEth32_Base_Power_Output (J6.5)
NetIC5_32: StEth32_Base_µC (IC6.25), StEth32_Base_W5500 (IC5.32)
NetIC5_33: StEth32_Base_µC (IC6.26), StEth32_Base_W5500 (IC5.33)
NetIC5_34: StEth32_Base_µC (IC6.27), StEth32_Base_W5500 (IC5.34)
NetIC5_35: StEth32_Base_µC (IC6.28), StEth32_Base_W5500 (IC5.35)
NetIC5_36: StEth32_Base_µC (IC6.32), StEth32_Base_W5500 (IC5.36)
NetIC6_2: StEth32_Base_µC (IC6.2), StEth32_Base_OLED_UserIO (LED2.1)
NetIC6_3: StEth32_Base_µC (IC6.3), StEth32_Base_OLED_UserIO (LED1.1)
NetIC6_4: StEth32_Base_µC (IC6.4), StEth32_Base_OLED_UserIO (R46.1 S1.S2)
NetIC6_10: StEth32_Base_µC (IC6.10), StEth32_Base_OLED_UserIO (S1.A)
NetIC6_11: StEth32_Base_µC (IC6.11), StEth32_Base_OLED_UserIO (S1.B)
NetIC6_12: StEth32_Base_µC (IC6.12), StEth32_Base_Power_Output (J3.6)
NetIC6_13: StEth32_Base_µC (IC6.13), StEth32_Base_Power_Output (J3.5)
NetIC6_21: StEth32_Base_µC (IC6.21), StEth32_Base_Power_Output (J3.3)
NetIC6_22: StEth32_Base_µC (IC6.22), StEth32_Base_Power_Output (J3.4)
NetIC6_29: StEth32_Base_µC (IC6.29), StEth32_Base_Power_Output (J6.2)
NetIC6_30: StEth32_Base_µC (IC6.30), StEth32_Base_Power_Output (J3.7)
NetIC6_31: StEth32_Base_µC (IC6.31), StEth32_Base_Power_Output (J3.8)
NetIC6_33: StEth32_Base_µC (IC6.33), StEth32_Base_Power_Output (J4.4)
NetIC6_38: StEth32_Base_µC (IC6.38), StEth32_Base_Power_Output (J5.3)
NetIC6_39: StEth32_Base_µC (IC6.39), StEth32_Base_Power_Output (J4.3)
NetIC6_40: StEth32_Base_µC (IC6.40), StEth32_Base_Power_Output (J4.6)
NetIC6_41: StEth32_Base_µC (IC6.41), StEth32_Base_Power_Output (J5.5)
NetIC6_45: StEth32_Base_µC (IC6.45), StEth32_Base_Power_Output (J5.2)
NetIC6_46: StEth32_Base_µC (IC6.46), StEth32_Base_Power_Output (J5.4)